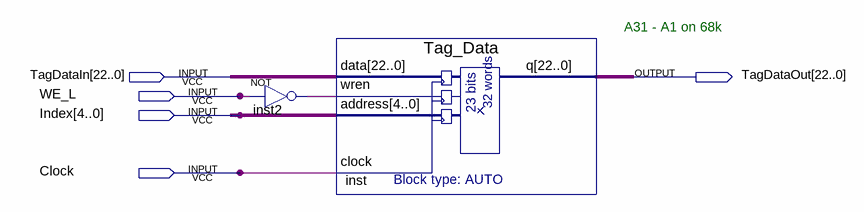
[diagram p0: schematic sheet]
// Quartus schematic TagMemory.bdf as structural Verilog: 2 symbols, 5 pins
module TagMemory (
  input  [22:0] TagDataIn,
  input  WE_L,
  input  [4:0] Index,
  input  Clock,
  output [22:0] TagDataOut
);

  wire inst2_out;

  not inst2 (inst2_out, WE_L);
  Tag_Data inst (.data(TagDataIn), .wren(inst2_out), .address(Index), .clock(Clock), .q(TagDataOut));

  // Notes on the sheet:
  //   A31 - A1 on 68k
endmodule
